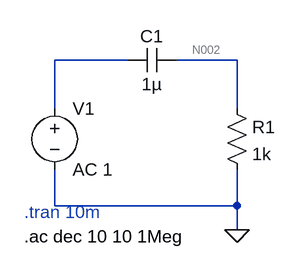
[diagram p0: schematic B_AC.asc]
B_AC.asc, the LTspice schematic file:
Version 4
SHEET 1 880 680
WIRE 160 144 64 144
WIRE 304 144 224 144
WIRE 64 208 64 144
WIRE 304 208 304 144
WIRE 64 336 64 288
WIRE 304 336 304 288
WIRE 304 336 64 336
WIRE 304 368 304 336
FLAG 304 368 0
SYMBOL cap 224 128 R90
WINDOW 0 0 32 VBottom 2
WINDOW 3 32 32 VTop 2
SYMATTR InstName C1
SYMATTR Value 1µ
SYMBOL res 288 192 R0
SYMATTR InstName R1
SYMATTR Value 1k
SYMBOL voltage 64 192 R0
WINDOW 123 0 0 Left 0
WINDOW 39 0 0 Left 0
SYMATTR InstName V1
SYMATTR Value AC 1
TEXT 24 344 Left 2 ;.tran 10m
TEXT 24 376 Left 2 !.ac dec 10 10 1Meg

The netlist it stands for:
* B_AC.asc
C1 N002 N001 1µ
R1 N002 0 1k
V1 N001 0 AC 1
* .tran 10m
.ac dec 10 10 1Meg
.backanno
.end

* Results of the author's LTspice run, read from the files saved beside the schematic
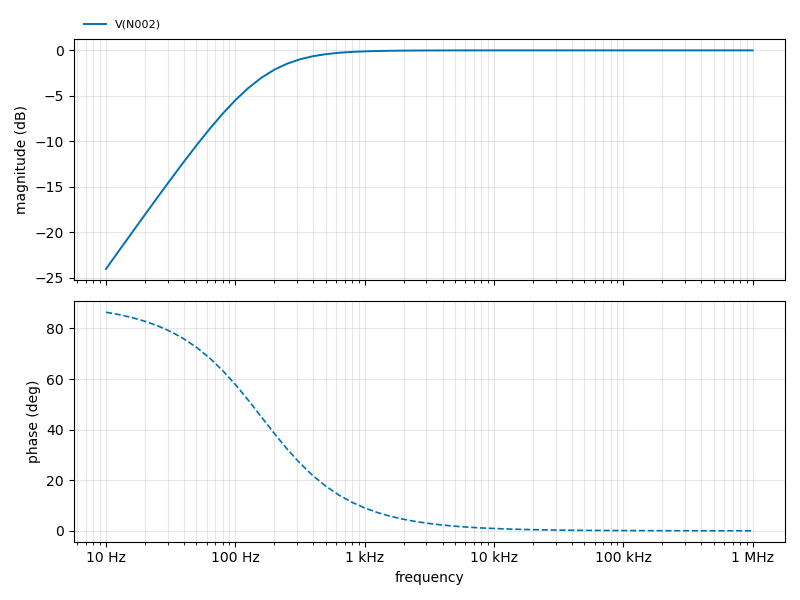
[diagram p1: AC Analysis of B_AC.asc, plotted from the saved traces]
* AC Analysis, 1 run:
*   V(N002): -24.05 dB at 10 Hz, -0.00 dB at 1 MHz, peak -0.00 dB at 1 MHz, 3 dB below the peak at 159.2 Hz